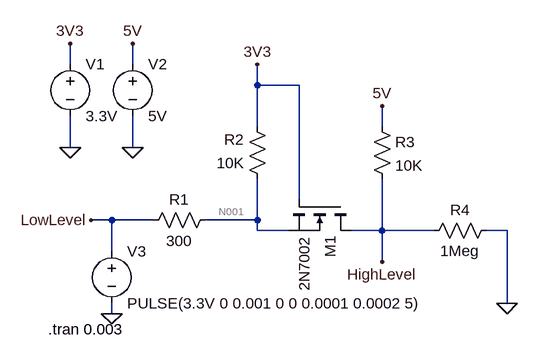
[diagram p0: schematic LevelShifter.asc]
LevelShifter.asc, the LTspice schematic file:
Version 4
SHEET 1 880 680
WIRE -96 -96 -96 -128
WIRE 0 -96 0 -128
WIRE 192 -64 192 -96
WIRE 256 -64 192 -64
WIRE 192 0 192 -64
WIRE 384 0 384 -32
WIRE -96 32 -96 -16
WIRE 0 32 0 -16
WIRE 256 112 256 -64
WIRE -32 144 -64 144
WIRE 32 144 -32 144
WIRE 192 144 192 80
WIRE 192 144 112 144
WIRE 192 160 192 144
WIRE 240 160 192 160
WIRE 384 160 384 80
WIRE 384 160 336 160
WIRE 464 160 384 160
WIRE 576 160 544 160
WIRE -32 192 -32 144
WIRE 384 208 384 160
WIRE 576 272 576 160
WIRE -32 288 -32 272
FLAG -96 32 0
FLAG 0 32 0
FLAG -96 -128 3V3
FLAG 192 -96 3V3
FLAG 0 -128 5V
FLAG 384 -32 5V
FLAG -32 288 0
FLAG 576 272 0
FLAG -64 144 LowLevel
FLAG 384 208 HighLevel
SYMBOL res 128 128 R90
WINDOW 0 0 56 VBottom 2
WINDOW 3 32 56 VTop 2
SYMATTR InstName R1
SYMATTR Value 300
SYMBOL res 208 96 R180
WINDOW 0 36 76 Left 2
WINDOW 3 36 40 Left 2
SYMATTR InstName R2
SYMATTR Value 10K
SYMBOL res 368 -16 R0
SYMATTR InstName R3
SYMATTR Value 10K
SYMBOL res 560 144 R90
WINDOW 0 0 56 VBottom 2
WINDOW 3 32 56 VTop 2
SYMATTR InstName R4
SYMATTR Value 1Meg
SYMBOL nmos 336 112 R90
SYMATTR InstName M1
SYMATTR Value 2N7002
SYMBOL voltage -96 -112 R0
WINDOW 123 0 0 Left 0
WINDOW 39 0 0 Left 0
SYMATTR InstName V1
SYMATTR Value 3.3V
SYMBOL voltage 0 -112 R0
WINDOW 123 0 0 Left 0
WINDOW 39 0 0 Left 0
SYMATTR InstName V2
SYMATTR Value 5V
SYMBOL voltage -32 176 R0
WINDOW 123 0 0 Left 0
WINDOW 39 0 0 Left 0
SYMATTR InstName V3
SYMATTR Value PULSE(3.3V 0 0.001 0 0 0.0001 0.0002 5)
TEXT -130 312 Left 2 !.tran 0.003

The netlist it stands for:
* LevelShifter.asc
R1 N001 LowLevel 300
R2 N001 3V3 10K
R3 5V HighLevel 10K
R4 0 HighLevel 1Meg
M1 HighLevel 3V3 N001 N001 2N7002
V1 3V3 0 3.3V
V2 5V 0 5V
V3 LowLevel 0 PULSE(3.3V 0 0.001 0 0 0.0001 0.0002 5)
.model NMOS NMOS
.model PMOS PMOS
.lib standard.mos
.tran 0.003
.backanno
.end

* Results of the author's LTspice run, read from the files saved beside the schematic
* Operating Point, zero values left out:
*   V(n001) = 3.3 V
*   V(lowlevel) = 3.3 V
*   V(3v3) = 3.3 V
*   V(5v) = 5 V
*   V(highlevel) = 4.95 V
*   Id(M1) = 1.688 pA
*   Is(M1) = -1.688 pA
*   I(R1) = 3.244 pA
*   I(R3) = 4.95 µA
*   I(R4) = -4.95 µA
*   I(V2) = -4.95 µA
*   I(V3) = 3.244 pA
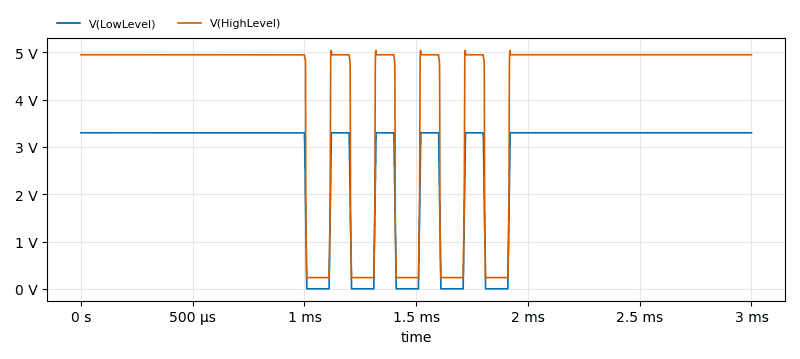
[diagram p1: Transient Analysis of LevelShifter.asc, plotted from the saved traces]
* Transient Analysis, 1 run:
*   V(LowLevel): min 0 V, max 3.3 V, average 2.695 V, rms 2.972 V, last 3.3 V
*   V(HighLevel): min 236.5 mV, max 5.043 V, average 4.096 V, rms 4.473 V, last 4.95 V